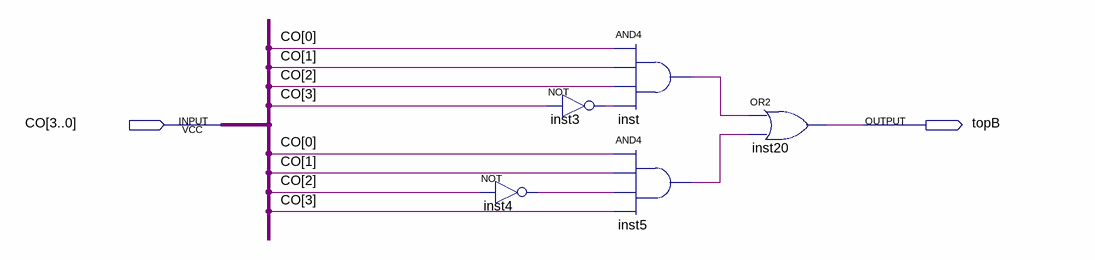
[diagram p0: schematic sheet]
// Quartus schematic ChooseTopB.bdf as structural Verilog: 5 symbols, 2 pins
module ChooseTopB (
  input  [3:0] CO,
  output topB
);

  wire inst3_out, inst4_out, inst5_out, inst_out;

  not inst4 (inst4_out, CO[2]);
  not inst3 (inst3_out, CO[3]);
  and inst (inst_out, CO[0], CO[1], CO[2], inst3_out);
  and inst5 (inst5_out, CO[0], CO[1], inst4_out, CO[3]);
  or inst20 (topB, inst_out, inst5_out);
endmodule
